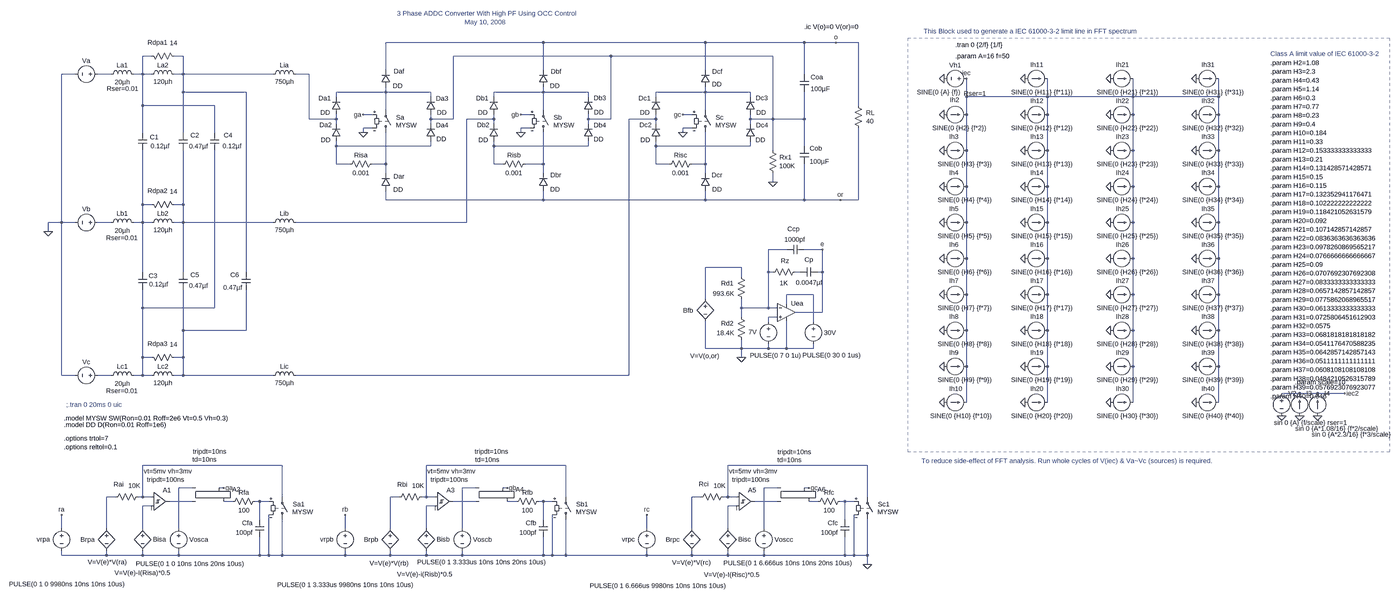
[diagram p0: schematic 3_Phase_High_PF_ACDC_Converter-add IEC61000-3-2 line (fix).asc, whole sheet]
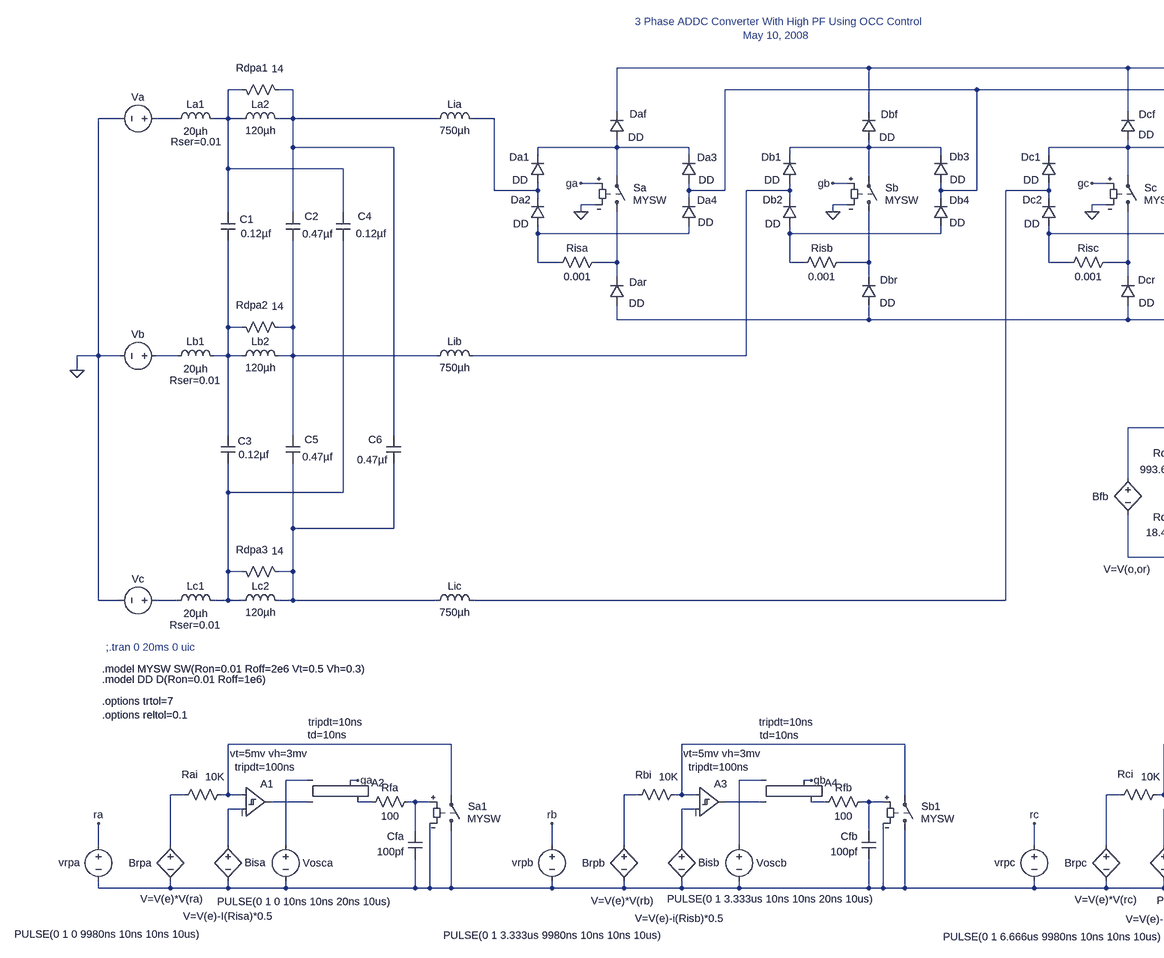
[diagram p1: schematic 3_Phase_High_PF_ACDC_Converter-add IEC61000-3-2 line (fix).asc, part, row 1 of 1, column 1 of 2]
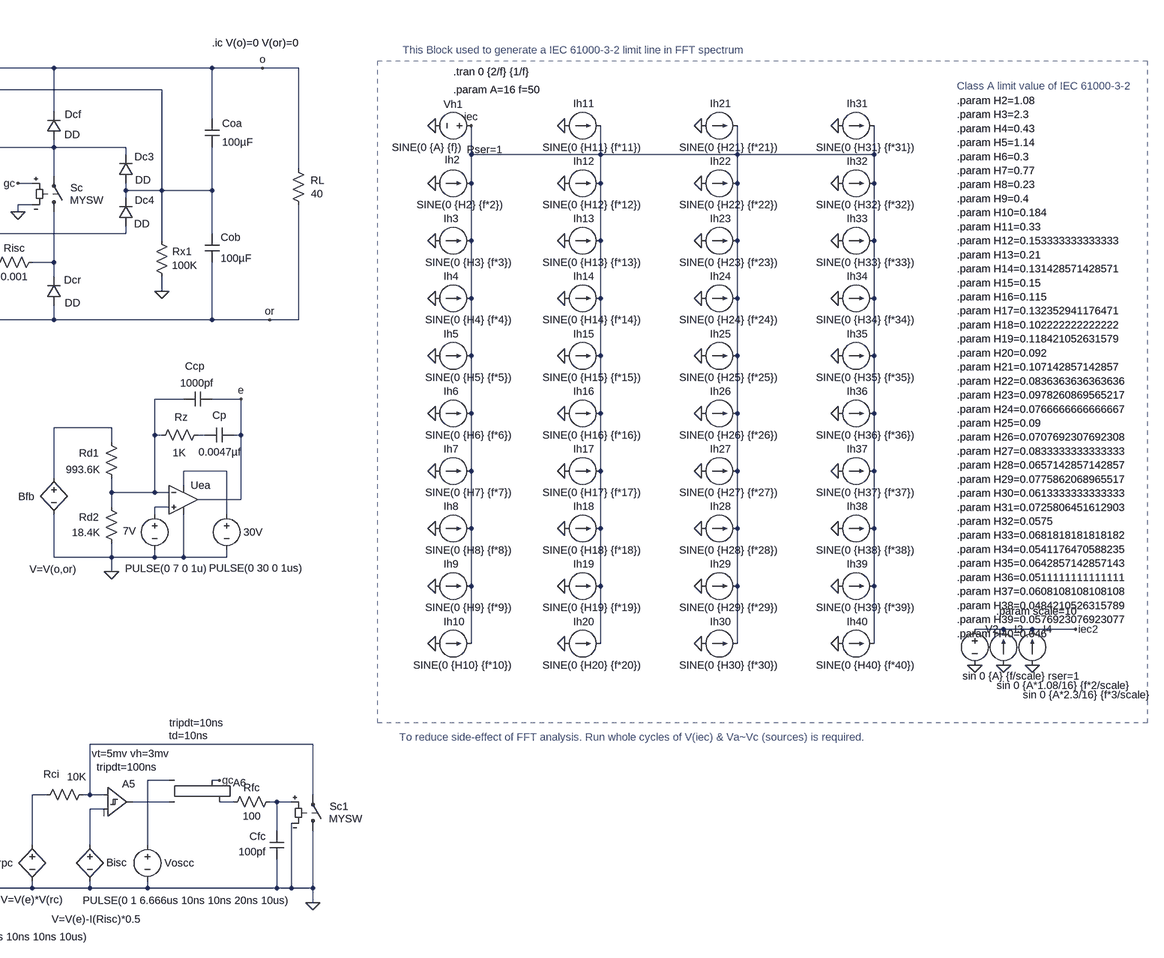
[diagram p2: schematic 3_Phase_High_PF_ACDC_Converter-add IEC61000-3-2 line (fix).asc, part, row 1 of 1, column 2 of 2]
3_Phase_High_PF_ACDC_Converter-add IEC61000-3-2 line (fix).asc, the LTspice schematic file:
Version 4
SHEET 1 1972 680
WIRE -1392 -2016 -1952 -2016
WIRE -816 -2016 -1392 -2016
WIRE -464 -2016 -816 -2016
WIRE -352 -2016 -464 -2016
WIRE -272 -2016 -352 -2016
WIRE -2784 -1968 -2816 -1968
WIRE -2672 -1968 -2704 -1968
WIRE -1152 -1968 -1712 -1968
WIRE -576 -1968 -1152 -1968
WIRE -1952 -1920 -1952 -2016
WIRE -1392 -1920 -1392 -2016
WIRE -816 -1920 -816 -2016
WIRE -3056 -1904 -3104 -1904
WIRE -2928 -1904 -2976 -1904
WIRE -2816 -1904 -2816 -1968
WIRE -2816 -1904 -2848 -1904
WIRE -2784 -1904 -2816 -1904
WIRE -2672 -1904 -2672 -1968
WIRE -2672 -1904 -2704 -1904
WIRE -2352 -1904 -2672 -1904
WIRE -2224 -1904 -2272 -1904
WIRE -464 -1904 -464 -2016
WIRE -2672 -1840 -2672 -1904
WIRE -2448 -1840 -2672 -1840
WIRE -1952 -1840 -1952 -1856
WIRE -1952 -1840 -2128 -1840
WIRE -1792 -1840 -1952 -1840
WIRE -1392 -1840 -1392 -1856
WIRE -1392 -1840 -1568 -1840
WIRE -1232 -1840 -1392 -1840
WIRE -816 -1840 -816 -1856
WIRE -816 -1840 -992 -1840
WIRE -656 -1840 -816 -1840
WIRE -2128 -1824 -2128 -1840
WIRE -1792 -1824 -1792 -1840
WIRE -1568 -1824 -1568 -1840
WIRE -1232 -1824 -1232 -1840
WIRE -992 -1824 -992 -1840
WIRE -656 -1824 -656 -1840
WIRE 112 -1824 112 -1888
WIRE 400 -1824 400 -1888
WIRE 400 -1824 112 -1824
WIRE 704 -1824 704 -1888
WIRE 704 -1824 400 -1824
WIRE 1008 -1824 1008 -1888
WIRE 1008 -1824 704 -1824
WIRE -2816 -1792 -2816 -1904
WIRE -2560 -1792 -2816 -1792
WIRE -272 -1792 -272 -2016
WIRE -1952 -1776 -1952 -1840
WIRE -1392 -1776 -1392 -1840
WIRE -816 -1776 -816 -1840
WIRE -2000 -1760 -2032 -1760
WIRE -1440 -1760 -1472 -1760
WIRE -864 -1760 -896 -1760
WIRE 112 -1760 112 -1824
WIRE 400 -1760 400 -1824
WIRE 704 -1760 704 -1824
WIRE 1008 -1760 1008 -1824
WIRE -2224 -1744 -2224 -1904
WIRE -2128 -1744 -2128 -1760
WIRE -2128 -1744 -2224 -1744
WIRE -1792 -1744 -1792 -1760
WIRE -1712 -1744 -1712 -1968
WIRE -1712 -1744 -1792 -1744
WIRE -1568 -1744 -1568 -1760
WIRE -1568 -1744 -1664 -1744
WIRE -1232 -1744 -1232 -1760
WIRE -1152 -1744 -1152 -1968
WIRE -1152 -1744 -1232 -1744
WIRE -992 -1744 -992 -1760
WIRE -992 -1744 -1088 -1744
WIRE -656 -1744 -656 -1760
WIRE -576 -1744 -576 -1968
WIRE -576 -1744 -656 -1744
WIRE -464 -1744 -464 -1840
WIRE -464 -1744 -576 -1744
WIRE -2128 -1728 -2128 -1744
WIRE -1792 -1728 -1792 -1744
WIRE -1568 -1728 -1568 -1744
WIRE -1232 -1728 -1232 -1744
WIRE -992 -1728 -992 -1744
WIRE -656 -1728 -656 -1744
WIRE -2000 -1712 -2032 -1712
WIRE -1440 -1712 -1472 -1712
WIRE -864 -1712 -896 -1712
WIRE -2816 -1696 -2816 -1792
WIRE -2672 -1696 -2672 -1840
WIRE -2560 -1696 -2560 -1792
WIRE -2032 -1696 -2032 -1712
WIRE -1472 -1696 -1472 -1712
WIRE -896 -1696 -896 -1712
WIRE -2128 -1648 -2128 -1664
WIRE -1792 -1648 -1792 -1664
WIRE -1792 -1648 -2128 -1648
WIRE -1568 -1648 -1568 -1664
WIRE -1232 -1648 -1232 -1664
WIRE -1232 -1648 -1568 -1648
WIRE -992 -1648 -992 -1664
WIRE -656 -1648 -656 -1664
WIRE -656 -1648 -992 -1648
WIRE -464 -1648 -464 -1744
WIRE -576 -1632 -576 -1744
WIRE 112 -1632 112 -1760
WIRE 400 -1632 400 -1760
WIRE 704 -1632 704 -1760
WIRE 1008 -1632 1008 -1760
WIRE -2128 -1584 -2128 -1648
WIRE -2080 -1584 -2128 -1584
WIRE -1952 -1584 -1952 -1696
WIRE -1952 -1584 -2000 -1584
WIRE -1568 -1584 -1568 -1648
WIRE -1536 -1584 -1568 -1584
WIRE -1392 -1584 -1392 -1696
WIRE -1392 -1584 -1456 -1584
WIRE -992 -1584 -992 -1648
WIRE -944 -1584 -992 -1584
WIRE -816 -1584 -816 -1696
WIRE -816 -1584 -864 -1584
WIRE -1952 -1552 -1952 -1584
WIRE -1392 -1552 -1392 -1584
WIRE -816 -1552 -816 -1584
WIRE -576 -1520 -576 -1552
WIRE 112 -1504 112 -1632
WIRE 400 -1504 400 -1632
WIRE 704 -1504 704 -1632
WIRE 1008 -1504 1008 -1632
WIRE -1952 -1456 -1952 -1488
WIRE -1392 -1456 -1392 -1488
WIRE -1392 -1456 -1952 -1456
WIRE -816 -1456 -816 -1488
WIRE -816 -1456 -1392 -1456
WIRE -464 -1456 -464 -1584
WIRE -464 -1456 -816 -1456
WIRE -336 -1456 -464 -1456
WIRE -272 -1456 -272 -1712
WIRE -272 -1456 -336 -1456
WIRE -2816 -1440 -2816 -1632
WIRE -2784 -1440 -2816 -1440
WIRE -2672 -1440 -2672 -1632
WIRE -2672 -1440 -2704 -1440
WIRE -3104 -1376 -3104 -1904
WIRE -3104 -1376 -3152 -1376
WIRE -3056 -1376 -3104 -1376
WIRE -2928 -1376 -2976 -1376
WIRE -2816 -1376 -2816 -1440
WIRE -2816 -1376 -2848 -1376
WIRE -2784 -1376 -2816 -1376
WIRE -2672 -1376 -2672 -1440
WIRE -2672 -1376 -2704 -1376
WIRE -2352 -1376 -2672 -1376
WIRE -1664 -1376 -1664 -1744
WIRE -1664 -1376 -2272 -1376
WIRE 112 -1376 112 -1504
WIRE 400 -1376 400 -1504
WIRE 704 -1376 704 -1504
WIRE 1008 -1376 1008 -1504
WIRE -3152 -1344 -3152 -1376
WIRE -528 -1280 -592 -1280
WIRE -400 -1280 -464 -1280
WIRE 112 -1248 112 -1376
WIRE 400 -1248 400 -1376
WIRE 704 -1248 704 -1376
WIRE 1008 -1248 1008 -1376
WIRE -688 -1216 -816 -1216
WIRE -2816 -1200 -2816 -1376
WIRE -2672 -1200 -2672 -1376
WIRE -2448 -1200 -2448 -1840
WIRE -592 -1200 -592 -1280
WIRE -576 -1200 -592 -1200
WIRE -480 -1200 -496 -1200
WIRE -400 -1200 -400 -1280
WIRE -400 -1200 -416 -1200
WIRE -688 -1184 -688 -1216
WIRE -432 -1120 -528 -1120
WIRE 112 -1120 112 -1248
WIRE 400 -1120 400 -1248
WIRE 704 -1120 704 -1248
WIRE 1008 -1120 1008 -1248
WIRE -816 -1104 -816 -1216
WIRE -528 -1088 -528 -1120
WIRE -2816 -1072 -2816 -1136
WIRE -2560 -1072 -2560 -1632
WIRE -2560 -1072 -2816 -1072
WIRE -688 -1072 -688 -1104
WIRE -592 -1072 -592 -1200
WIRE -592 -1072 -688 -1072
WIRE -560 -1072 -592 -1072
WIRE -400 -1056 -400 -1200
WIRE -400 -1056 -496 -1056
WIRE -688 -1040 -688 -1072
WIRE -560 -1040 -592 -1040
WIRE -592 -1024 -592 -1040
WIRE -432 -1024 -432 -1120
WIRE -2672 -992 -2672 -1136
WIRE -2448 -992 -2448 -1136
WIRE -2448 -992 -2672 -992
WIRE 112 -992 112 -1120
WIRE 400 -992 400 -1120
WIRE 704 -992 704 -1120
WIRE 1008 -992 1008 -1120
WIRE -816 -928 -816 -1024
WIRE -688 -928 -688 -960
WIRE -688 -928 -816 -928
WIRE -592 -928 -592 -944
WIRE -592 -928 -688 -928
WIRE -528 -928 -528 -1024
WIRE -528 -928 -592 -928
WIRE -432 -928 -432 -944
WIRE -432 -928 -528 -928
WIRE -2816 -896 -2816 -1072
WIRE -2784 -896 -2816 -896
WIRE -2672 -896 -2672 -992
WIRE -2672 -896 -2704 -896
WIRE -688 -896 -688 -928
WIRE 112 -864 112 -992
WIRE 400 -864 400 -992
WIRE 704 -864 704 -992
WIRE 1008 -864 1008 -992
WIRE -3104 -832 -3104 -1376
WIRE -3056 -832 -3104 -832
WIRE -2928 -832 -2976 -832
WIRE -2816 -832 -2816 -896
WIRE -2816 -832 -2848 -832
WIRE -2784 -832 -2816 -832
WIRE -2672 -832 -2672 -896
WIRE -2672 -832 -2704 -832
WIRE -2352 -832 -2672 -832
WIRE -1088 -832 -1088 -1744
WIRE -1088 -832 -2272 -832
WIRE 1296 -768 1232 -768
WIRE 1360 -768 1296 -768
WIRE 1456 -768 1360 -768
WIRE 112 -736 112 -864
WIRE 400 -736 400 -864
WIRE 704 -736 704 -864
WIRE 1008 -736 1008 -864
WIRE -2320 -512 -2816 -512
WIRE -1312 -512 -1808 -512
WIRE -240 -512 -736 -512
WIRE -2640 -432 -2688 -432
WIRE -2528 -432 -2544 -432
WIRE -1632 -432 -1680 -432
WIRE -1520 -432 -1536 -432
WIRE -560 -432 -608 -432
WIRE -448 -432 -464 -432
WIRE -2912 -400 -2944 -400
WIRE -2816 -400 -2816 -512
WIRE -2816 -400 -2832 -400
WIRE -2784 -400 -2816 -400
WIRE -2320 -400 -2320 -512
WIRE -1904 -400 -1936 -400
WIRE -1808 -400 -1808 -512
WIRE -1808 -400 -1824 -400
WIRE -1776 -400 -1808 -400
WIRE -1312 -400 -1312 -512
WIRE -832 -400 -864 -400
WIRE -736 -400 -736 -512
WIRE -736 -400 -752 -400
WIRE -704 -400 -736 -400
WIRE -240 -400 -240 -512
WIRE -2640 -384 -2720 -384
WIRE -2496 -384 -2528 -384
WIRE -2400 -384 -2416 -384
WIRE -2368 -384 -2400 -384
WIRE -1632 -384 -1712 -384
WIRE -1488 -384 -1520 -384
WIRE -1392 -384 -1408 -384
WIRE -1360 -384 -1392 -384
WIRE -560 -384 -640 -384
WIRE -416 -384 -448 -384
WIRE -320 -384 -336 -384
WIRE -288 -384 -320 -384
WIRE -2784 -368 -2816 -368
WIRE -1776 -368 -1808 -368
WIRE -704 -368 -736 -368
WIRE -2400 -320 -2400 -384
WIRE -1392 -320 -1392 -384
WIRE -320 -320 -320 -384
WIRE -3104 -288 -3104 -336
WIRE -2944 -288 -2944 -400
WIRE -2816 -288 -2816 -368
WIRE -2688 -288 -2688 -432
WIRE -2096 -288 -2096 -336
WIRE -1936 -288 -1936 -400
WIRE -1808 -288 -1808 -368
WIRE -1680 -288 -1680 -432
WIRE -1024 -288 -1024 -336
WIRE -864 -288 -864 -400
WIRE -736 -288 -736 -368
WIRE -608 -288 -608 -432
WIRE -3104 -192 -3104 -208
WIRE -2944 -192 -2944 -208
WIRE -2944 -192 -3104 -192
WIRE -2816 -192 -2816 -208
WIRE -2816 -192 -2944 -192
WIRE -2688 -192 -2688 -208
WIRE -2688 -192 -2816 -192
WIRE -2400 -192 -2400 -256
WIRE -2400 -192 -2688 -192
WIRE -2368 -192 -2368 -336
WIRE -2368 -192 -2400 -192
WIRE -2320 -192 -2320 -320
WIRE -2320 -192 -2368 -192
WIRE -2096 -192 -2096 -208
WIRE -2096 -192 -2320 -192
WIRE -1936 -192 -1936 -208
WIRE -1936 -192 -2096 -192
WIRE -1808 -192 -1808 -208
WIRE -1808 -192 -1936 -192
WIRE -1680 -192 -1680 -208
WIRE -1680 -192 -1808 -192
WIRE -1392 -192 -1392 -256
WIRE -1392 -192 -1680 -192
WIRE -1360 -192 -1360 -336
WIRE -1360 -192 -1392 -192
WIRE -1312 -192 -1312 -320
WIRE -1312 -192 -1360 -192
WIRE -1024 -192 -1024 -208
WIRE -1024 -192 -1312 -192
WIRE -864 -192 -864 -208
WIRE -864 -192 -1024 -192
WIRE -736 -192 -736 -208
WIRE -736 -192 -864 -192
WIRE -608 -192 -608 -208
WIRE -608 -192 -736 -192
WIRE -320 -192 -320 -256
WIRE -320 -192 -608 -192
WIRE -288 -192 -288 -336
WIRE -288 -192 -320 -192
WIRE -240 -192 -240 -320
WIRE -240 -192 -288 -192
WIRE -240 -160 -240 -192
FLAG -576 -1520 0
FLAG -352 -2016 o
FLAG -3104 -336 ra
FLAG -2528 -432 ga
FLAG -1520 -432 gb
FLAG -448 -432 gc
FLAG -2096 -336 rb
FLAG -1024 -336 rc
FLAG -400 -1280 e
FLAG -688 -896 0
FLAG -336 -1456 or
FLAG -240 -160 0
FLAG -2032 -1760 ga
FLAG -2032 -1696 0
FLAG -1472 -1760 gb
FLAG -1472 -1696 0
FLAG -896 -1760 gc
FLAG -896 -1696 0
FLAG -3152 -1344 0
FLAG 32 -1888 0
FLAG 32 -1760 0
FLAG 32 -1632 0
FLAG 112 -1888 iec
FLAG 1232 -688 0
FLAG 1296 -688 0
FLAG 1360 -688 0
FLAG 1456 -768 iec2
FLAG 32 -1504 0
FLAG 32 -1376 0
FLAG 32 -1248 0
FLAG 32 -1120 0
FLAG 32 -992 0
FLAG 32 -864 0
FLAG 32 -736 0
FLAG 320 -1888 0
FLAG 320 -1760 0
FLAG 320 -1632 0
FLAG 320 -1504 0
FLAG 320 -1376 0
FLAG 320 -1248 0
FLAG 320 -1120 0
FLAG 320 -992 0
FLAG 320 -864 0
FLAG 320 -736 0
FLAG 624 -1888 0
FLAG 624 -1760 0
FLAG 624 -1632 0
FLAG 624 -1504 0
FLAG 624 -1376 0
FLAG 624 -1248 0
FLAG 624 -1120 0
FLAG 624 -992 0
FLAG 624 -864 0
FLAG 624 -736 0
FLAG 928 -1888 0
FLAG 928 -1760 0
FLAG 928 -1632 0
FLAG 928 -1504 0
FLAG 928 -1376 0
FLAG 928 -1248 0
FLAG 928 -1120 0
FLAG 928 -992 0
FLAG 928 -864 0
FLAG 928 -736 0
SYMBOL ind -2368 -1888 R270
WINDOW 0 32 56 VTop 2
WINDOW 3 5 56 VBottom 2
SYMATTR InstName Lia
SYMATTR Value 750µh
SYMATTR Type ind2
SYMATTR SpiceLine Rser=0.01
SYMBOL ind -2368 -1360 R270
WINDOW 0 32 56 VTop 2
WINDOW 3 5 56 VBottom 2
SYMATTR InstName Lib
SYMATTR Value 750µh
SYMATTR Type ind2
SYMATTR SpiceLine Rser=0.01
SYMBOL ind -2368 -816 R270
WINDOW 0 32 56 VTop 2
WINDOW 3 5 56 VBottom 2
SYMATTR InstName Lic
SYMATTR Value 750µh
SYMATTR Type ind2
SYMATTR SpiceLine Rser=0.01
SYMBOL cap -480 -1648 R0
WINDOW 0 35 8 Left 2
WINDOW 3 35 55 Left 2
SYMATTR InstName Cob
SYMATTR Value 100µF
SYMATTR SpiceLine Rser=0.1
SYMBOL cap -480 -1904 R0
WINDOW 0 38 11 Left 2
WINDOW 3 38 53 Left 2
SYMATTR InstName Coa
SYMATTR Value 100µF
SYMATTR SpiceLine Rser=0.1
SYMBOL res -288 -1808 R0
WINDOW 0 43 42 Left 2
WINDOW 3 44 72 Left 2
SYMATTR InstName RL
SYMATTR Value 40
SYMBOL res -1984 -1600 R90
WINDOW 0 0 56 VBottom 2
WINDOW 3 32 56 VTop 2
SYMATTR InstName Risa
SYMATTR Value 0.001
SYMBOL res -1440 -1600 R90
WINDOW 0 0 56 VBottom 2
WINDOW 3 32 56 VTop 2
SYMATTR InstName Risb
SYMATTR Value 0.001
SYMBOL res -848 -1600 R90
WINDOW 0 0 56 VBottom 2
WINDOW 3 32 56 VTop 2
SYMATTR InstName Risc
SYMATTR Value 0.001
SYMBOL res -560 -1536 R180
WINDOW 0 -50 72 Left 2
WINDOW 3 -63 41 Left 2
SYMATTR InstName Rx1
SYMATTR Value 100K
SYMBOL voltage -3104 -304 R0
WINDOW 0 -89 55 Left 2
WINDOW 3 -187 214 Left 2
WINDOW 123 0 0 Left 2
WINDOW 39 0 0 Left 2
SYMATTR InstName vrpa
SYMATTR Value PULSE(0 1 0 9980ns 10ns 10ns 10us)
SYMBOL bv -2944 -304 R0
WINDOW 0 -93 56 Left 2
WINDOW 3 -67 136 Left 2
SYMATTR InstName Brpa
SYMATTR Value V=V(e)*V(ra)
SYMBOL Digital\\diffschmtbuf -2784 -448 R0
WINDOW 3 -17 -13 Left 2
WINDOW 123 -28 -43 Left 2
SYMATTR Value tripdt=100ns
SYMATTR Value2 vt=5mv vh=3mv
SYMATTR InstName A1
SYMBOL Digital\\srflop -2592 -480 R0
WINDOW 3 -46 -81 Left 2
WINDOW 123 -47 -53 Left 2
SYMATTR Value tripdt=10ns
SYMATTR Value2 td=10ns
SYMATTR InstName A2
SYMBOL voltage -2688 -304 R0
WINDOW 0 38 56 Left 2
WINDOW 3 -152 142 Left 2
WINDOW 123 0 0 Left 2
WINDOW 39 0 0 Left 2
SYMATTR InstName Vosca
SYMATTR Value PULSE(0 1 0 10ns 10ns 20ns 10us)
SYMBOL res -2816 -416 R90
WINDOW 0 -13 85 VBottom 2
WINDOW 3 -39 29 VTop 2
SYMATTR InstName Rai
SYMATTR Value 10K
SYMBOL sw -2320 -304 M180
WINDOW 0 37 70 Left 2
WINDOW 3 36 42 Left 2
SYMATTR InstName Sa1
SYMATTR Value MYSW
SYMBOL res -2400 -400 R90
WINDOW 0 0 56 VBottom 2
WINDOW 3 32 56 VTop 2
SYMATTR InstName Rfa
SYMATTR Value 100
SYMBOL cap -2384 -320 M0
WINDOW 0 41 13 Left 2
WINDOW 3 40 47 Left 2
SYMATTR InstName Cfa
SYMATTR Value 100pf
SYMBOL bv -2816 -304 R0
WINDOW 0 37 55 Left 2
WINDOW 3 -100 174 Left 2
SYMATTR InstName Bisa
SYMATTR Value V=V(e)-I(Risa)*0.5
SYMBOL Digital\\diffschmtbuf -1776 -448 R0
WINDOW 3 -17 -13 Left 2
WINDOW 123 -28 -43 Left 2
SYMATTR Value tripdt=100ns
SYMATTR Value2 vt=5mv vh=3mv
SYMATTR InstName A3
SYMBOL Digital\\srflop -1584 -480 R0
WINDOW 3 -52 -81 Left 2
WINDOW 123 -50 -52 Left 2
SYMATTR Value tripdt=10ns
SYMATTR Value2 td=10ns
SYMATTR InstName A4
SYMBOL res -1808 -416 R90
WINDOW 0 -12 85 VBottom 2
WINDOW 3 -39 29 VTop 2
SYMATTR InstName Rbi
SYMATTR Value 10K
SYMBOL sw -1312 -304 M180
WINDOW 0 37 70 Left 2
WINDOW 3 36 42 Left 2
SYMATTR InstName Sb1
SYMATTR Value MYSW
SYMBOL res -1392 -400 R90
WINDOW 0 0 56 VBottom 2
WINDOW 3 32 56 VTop 2
SYMATTR InstName Rfb
SYMATTR Value 100
SYMBOL cap -1376 -320 M0
WINDOW 0 41 13 Left 2
WINDOW 3 40 47 Left 2
SYMATTR InstName Cfb
SYMATTR Value 100pf
SYMBOL bv -1808 -304 R0
WINDOW 0 37 55 Left 2
WINDOW 3 -104 179 Left 2
SYMATTR InstName Bisb
SYMATTR Value V=V(e)-i(Risb)*0.5
SYMBOL Digital\\diffschmtbuf -704 -448 R0
WINDOW 3 -17 -13 Left 2
WINDOW 123 -28 -43 Left 2
SYMATTR Value tripdt=100ns
SYMATTR Value2 vt=5mv vh=3mv
SYMATTR InstName A5
SYMBOL Digital\\srflop -512 -480 R0
WINDOW 3 -47 -80 Left 2
WINDOW 123 -48 -51 Left 2
SYMATTR Value tripdt=10ns
SYMATTR Value2 td=10ns
SYMATTR InstName A6
SYMBOL res -736 -416 R90
WINDOW 0 -14 86 VBottom 2
WINDOW 3 -39 29 VTop 2
SYMATTR InstName Rci
SYMATTR Value 10K
SYMBOL sw -240 -304 M180
WINDOW 0 37 70 Left 2
WINDOW 3 36 42 Left 2
SYMATTR InstName Sc1
SYMATTR Value MYSW
SYMBOL res -320 -400 R90
WINDOW 0 0 56 VBottom 2
WINDOW 3 32 56 VTop 2
SYMATTR InstName Rfc
SYMATTR Value 100
SYMBOL cap -304 -320 M0
WINDOW 0 41 13 Left 2
WINDOW 3 40 47 Left 2
SYMATTR InstName Cfc
SYMATTR Value 100pf
SYMBOL bv -736 -304 R0
WINDOW 0 37 55 Left 2
WINDOW 3 -85 181 Left 2
SYMATTR InstName Bisc
SYMATTR Value V=V(e)-I(Risc)*0.5
SYMBOL voltage -2096 -304 R0
WINDOW 0 -89 55 Left 2
WINDOW 3 -242 217 Left 2
WINDOW 123 0 0 Left 2
WINDOW 39 0 0 Left 2
SYMATTR InstName vrpb
SYMATTR Value PULSE(0 1 3.333us 9980ns 10ns 10ns 10us)
SYMBOL bv -1936 -304 R0
WINDOW 0 -93 56 Left 2
WINDOW 3 -73 140 Left 2
SYMATTR InstName Brpb
SYMATTR Value V=V(e)*V(rb)
SYMBOL voltage -1024 -304 R0
WINDOW 0 -89 55 Left 2
WINDOW 3 -203 220 Left 2
WINDOW 123 0 0 Left 2
WINDOW 39 0 0 Left 2
SYMATTR InstName vrpc
SYMATTR Value PULSE(0 1 6.666us 9980ns 10ns 10ns 10us)
SYMBOL bv -864 -304 R0
WINDOW 0 -93 56 Left 2
WINDOW 3 -70 138 Left 2
SYMATTR InstName Brpc
SYMATTR Value V=V(e)*V(rc)
SYMBOL voltage -1680 -304 R0
WINDOW 0 38 56 Left 2
WINDOW 3 -160 136 Left 2
WINDOW 123 0 0 Left 2
WINDOW 39 0 0 Left 2
SYMATTR InstName Voscb
SYMATTR Value PULSE(0 1 3.333us 10ns 10ns 20ns 10us)
SYMBOL voltage -608 -304 R0
WINDOW 0 38 56 Left 2
WINDOW 3 -144 139 Left 2
WINDOW 123 0 0 Left 2
WINDOW 39 0 0 Left 2
SYMATTR InstName Voscc
SYMATTR Value PULSE(0 1 6.666us 10ns 10ns 20ns 10us)
SYMBOL res -704 -1200 R0
WINDOW 0 -56 40 Left 2
WINDOW 3 -85 77 Left 2
SYMATTR InstName Rd1
SYMATTR Value 993.6K
SYMBOL res -704 -1056 R0
WINDOW 0 -56 39 Left 2
WINDOW 3 -72 73 Left 2
SYMATTR InstName Rd2
SYMATTR Value 18.4K
SYMBOL res -480 -1216 R90
WINDOW 0 -8 53 VBottom 2
WINDOW 3 40 57 VTop 2
SYMATTR InstName Rz
SYMATTR Value 1K
SYMBOL cap -416 -1216 R90
WINDOW 0 -12 32 VBottom 2
WINDOW 3 38 31 VTop 2
SYMATTR InstName Cp
SYMATTR Value 0.0047µf
SYMBOL cap -464 -1296 R90
WINDOW 0 -41 39 VBottom 2
WINDOW 3 -35 34 VTop 2
SYMATTR InstName Ccp
SYMATTR Value 1000pf
SYMBOL voltage -592 -1040 R0
WINDOW 0 -71 54 Left 2
WINDOW 3 -66 137 Left 2
WINDOW 123 0 0 Left 2
WINDOW 39 0 0 Left 2
SYMATTR InstName 7V
SYMATTR Value PULSE(0 7 0 1u)
SYMBOL bv -816 -1120 R0
WINDOW 0 -79 57 Left 2
WINDOW 3 -54 219 Left 2
SYMATTR InstName Bfb
SYMATTR Value V=V(o,or)
SYMBOL voltage -432 -1040 R0
WINDOW 0 38 56 Left 2
WINDOW 3 -39 136 Left 2
WINDOW 123 0 0 Left 2
WINDOW 39 0 0 Left 2
SYMATTR InstName 30V
SYMATTR Value PULSE(0 30 0 1us)
SYMBOL sw -1952 -1680 M180
WINDOW 0 37 70 Left 2
WINDOW 3 36 42 Left 2
SYMATTR InstName Sa
SYMATTR Value MYSW
SYMBOL sw -1392 -1680 M180
WINDOW 0 37 70 Left 2
WINDOW 3 36 42 Left 2
SYMATTR InstName Sb
SYMATTR Value MYSW
SYMBOL sw -816 -1680 M180
WINDOW 0 37 70 Left 2
WINDOW 3 36 42 Left 2
SYMATTR InstName Sc
SYMATTR Value MYSW
SYMBOL diode -2112 -1760 R180
WINDOW 0 35 58 Left 2
WINDOW 3 38 7 Left 2
SYMATTR InstName Da1
SYMATTR Value DD
SYMBOL diode -2112 -1664 R180
WINDOW 0 31 59 Left 2
WINDOW 3 36 6 Left 2
SYMATTR InstName Da2
SYMATTR Value DD
SYMBOL diode -1776 -1760 R180
WINDOW 0 -47 57 Left 2
WINDOW 3 -40 7 Left 2
SYMATTR InstName Da3
SYMATTR Value DD
SYMBOL diode -1776 -1664 R180
WINDOW 0 -47 58 Left 2
WINDOW 3 -39 9 Left 2
SYMATTR InstName Da4
SYMATTR Value DD
SYMBOL diode -1552 -1760 R180
WINDOW 0 35 58 Left 2
WINDOW 3 38 7 Left 2
SYMATTR InstName Db1
SYMATTR Value DD
SYMBOL diode -1552 -1664 R180
WINDOW 0 31 59 Left 2
WINDOW 3 36 6 Left 2
SYMATTR InstName Db2
SYMATTR Value DD
SYMBOL diode -1216 -1760 R180
WINDOW 0 -48 59 Left 2
WINDOW 3 -39 8 Left 2
SYMATTR InstName Db3
SYMATTR Value DD
SYMBOL diode -1216 -1664 R180
WINDOW 0 -48 58 Left 2
WINDOW 3 -38 8 Left 2
SYMATTR InstName Db4
SYMATTR Value DD
SYMBOL diode -976 -1760 R180
WINDOW 0 35 58 Left 2
WINDOW 3 38 7 Left 2
SYMATTR InstName Dc1
SYMATTR Value DD
SYMBOL diode -976 -1664 R180
WINDOW 0 31 59 Left 2
WINDOW 3 36 6 Left 2
SYMATTR InstName Dc2
SYMATTR Value DD
SYMBOL diode -640 -1760 R180
WINDOW 0 -46 59 Left 2
WINDOW 3 -39 7 Left 2
SYMATTR InstName Dc3
SYMATTR Value DD
SYMBOL diode -640 -1664 R180
WINDOW 0 -47 58 Left 2
WINDOW 3 -37 6 Left 2
SYMATTR InstName Dc4
SYMATTR Value DD
SYMBOL diode -1936 -1856 R180
WINDOW 0 -50 58 Left 2
WINDOW 3 -44 6 Left 2
SYMATTR InstName Daf
SYMATTR Value DD
SYMBOL diode -1376 -1856 R180
WINDOW 0 -48 57 Left 2
WINDOW 3 -42 6 Left 2
SYMATTR InstName Dbf
SYMATTR Value DD
SYMBOL diode -800 -1856 R180
WINDOW 0 -44 57 Left 2
WINDOW 3 -42 12 Left 2
SYMATTR InstName Dcf
SYMATTR Value DD
SYMBOL diode -1936 -1488 R180
WINDOW 0 -51 52 Left 2
WINDOW 3 -45 5 Left 2
SYMATTR InstName Dar
SYMATTR Value DD
SYMBOL diode -1376 -1488 R180
WINDOW 0 -48 57 Left 2
WINDOW 3 -43 6 Left 2
SYMATTR InstName Dbr
SYMATTR Value DD
SYMBOL diode -800 -1488 R180
WINDOW 0 -44 57 Left 2
WINDOW 3 -43 6 Left 2
SYMATTR InstName Dcr
SYMATTR Value DD
SYMBOL voltage -2960 -1904 R90
WINDOW 0 -32 56 VBottom 2
WINDOW 3 32 56 Invisible 2
WINDOW 123 0 0 Left 2
WINDOW 39 0 0 Left 2
SYMATTR InstName Va
SYMATTR Value SINE(0 134 {f})
SYMBOL voltage -2960 -1376 R90
WINDOW 0 -32 56 VBottom 2
WINDOW 3 32 56 Invisible 2
WINDOW 123 0 0 Left 2
WINDOW 39 0 0 Left 2
SYMATTR InstName Vb
SYMATTR Value SINE(0 134 {f} 0 0 120)
SYMBOL voltage -2960 -832 R90
WINDOW 0 -32 56 VBottom 2
WINDOW 3 32 56 Invisible 2
WINDOW 123 0 0 Left 2
WINDOW 39 0 0 Left 2
SYMATTR InstName Vc
SYMATTR Value SINE(0 134 {f} 0 0 240)
SYMBOL ind -2944 -1888 R270
WINDOW 0 32 56 VTop 2
WINDOW 3 3 56 VBottom 2
WINDOW 39 -20 57 VBottom 2
SYMATTR InstName La1
SYMATTR Value 20µh
SYMATTR SpiceLine Rser=0.01
SYMBOL ind -2800 -1888 R270
WINDOW 0 32 56 VTop 2
WINDOW 3 5 56 VBottom 2
SYMATTR InstName La2
SYMATTR Value 120µh
SYMATTR SpiceLine Rser=0.01
SYMBOL cap -2832 -1696 R0
WINDOW 0 42 16 Left 2
WINDOW 3 44 48 Left 2
SYMATTR InstName C1
SYMATTR Value 0.12µf
SYMATTR SpiceLine Rser=0.01 Cpar=100pf
SYMBOL cap -2688 -1696 R0
WINDOW 0 42 10 Left 2
WINDOW 3 37 49 Left 2
SYMATTR InstName C2
SYMATTR Value 0.47µf
SYMATTR SpiceLine Rser=0.01 Cpar=100pf
SYMBOL res -2800 -1984 M90
WINDOW 0 -17 37 VBottom 2
WINDOW 3 -46 94 VTop 2
SYMATTR InstName Rdpa1
SYMATTR Value 14
SYMBOL ind -2944 -1360 R270
WINDOW 0 32 56 VTop 2
WINDOW 3 3 56 VBottom 2
WINDOW 39 -23 54 VBottom 2
SYMATTR InstName Lb1
SYMATTR Value 20µh
SYMATTR SpiceLine Rser=0.01
SYMBOL ind -2800 -1360 R270
WINDOW 0 32 56 VTop 2
WINDOW 3 5 56 VBottom 2
SYMATTR InstName Lb2
SYMATTR Value 120µh
SYMATTR SpiceLine Rser=0.01
SYMBOL cap -2832 -1200 R0
WINDOW 0 38 14 Left 2
WINDOW 3 39 44 Left 2
SYMATTR InstName C3
SYMATTR Value 0.12µf
SYMATTR SpiceLine Rser=0.01 Cpar=100pf
SYMBOL res -2800 -1456 M90
WINDOW 0 -17 37 VBottom 2
WINDOW 3 -46 94 VTop 2
SYMATTR InstName Rdpa2
SYMATTR Value 14
SYMBOL ind -2944 -816 R270
WINDOW 0 32 56 VTop 2
WINDOW 3 3 56 VBottom 2
WINDOW 39 -23 54 VBottom 2
SYMATTR InstName Lc1
SYMATTR Value 20µh
SYMATTR SpiceLine Rser=0.01
SYMBOL ind -2800 -816 R270
WINDOW 0 32 56 VTop 2
WINDOW 3 5 56 VBottom 2
SYMATTR InstName Lc2
SYMATTR Value 120µh
SYMATTR SpiceLine Rser=0.01
SYMBOL res -2800 -912 M90
WINDOW 0 -17 37 VBottom 2
WINDOW 3 -46 94 VTop 2
SYMATTR InstName Rdpa3
SYMATTR Value 14
SYMBOL cap -2576 -1696 R0
WINDOW 0 48 10 Left 2
WINDOW 3 44 48 Left 2
SYMATTR InstName C4
SYMATTR Value 0.12µf
SYMATTR SpiceLine Rser=0.01 Cpar=100pf
SYMBOL cap -2688 -1200 R0
WINDOW 0 42 10 Left 2
WINDOW 3 37 49 Left 2
SYMATTR InstName C5
SYMATTR Value 0.47µf
SYMATTR SpiceLine Rser=0.01 Cpar=100pf
SYMBOL cap -2464 -1200 R0
WINDOW 0 -40 10 Left 2
WINDOW 3 -65 55 Left 2
SYMATTR InstName C6
SYMATTR Value 0.47µf
SYMATTR SpiceLine Rser=0.01 Cpar=100pf
SYMBOL Opamps\\UniversalOpamp2 -528 -1056 R0
SYMATTR InstName Uea
SYMBOL voltage 128 -1888 R90
WINDOW 3 33 115 VTop 2
WINDOW 0 -32 56 VBottom 2
WINDOW 123 0 0 Left 2
WINDOW 39 38 -14 VTop 2
SYMATTR Value SINE(0 {A} {f})
SYMATTR InstName Vh1
SYMATTR SpiceLine Rser=1
SYMBOL current 32 -1760 M90
WINDOW 0 -52 55 VLeft 2
WINDOW 3 48 55 VCenter 2
WINDOW 123 0 0 Left 2
WINDOW 39 0 0 Left 2
SYMATTR InstName Ih2
SYMATTR Value SINE(0 {H2} {f*2})
SYMBOL current 32 -1632 M90
WINDOW 0 -49 19 VRight 2
WINDOW 3 48 170 VLeft 2
WINDOW 123 0 0 Left 2
WINDOW 39 0 0 Left 2
SYMATTR InstName Ih3
SYMATTR Value SINE(0 {H3} {f*3})
SYMBOL voltage 1232 -784 R0
WINDOW 3 -27 120 Left 2
SYMATTR Value sin 0 {A} {f/scale} rser=1
SYMATTR InstName V2
SYMBOL current 1296 -688 M180
WINDOW 0 24 80 Left 2
WINDOW 3 -15 -45 Left 2
SYMATTR InstName I3
SYMATTR Value sin 0 {A*1.08/16} {f*2/scale}
SYMBOL current 1360 -688 M180
WINDOW 0 24 80 Left 2
WINDOW 3 -21 -66 Left 2
SYMATTR InstName I4
SYMATTR Value sin 0 {A*2.3/16} {f*3/scale}
SYMBOL current 32 -1504 M90
WINDOW 0 -49 19 VRight 2
WINDOW 3 48 170 VLeft 2
WINDOW 123 0 0 Left 2
WINDOW 39 0 0 Left 2
SYMATTR InstName Ih4
SYMATTR Value SINE(0 {H4} {f*4})
SYMBOL current 32 -1376 M90
WINDOW 0 -49 19 VRight 2
WINDOW 3 48 170 VLeft 2
WINDOW 123 0 0 Left 2
WINDOW 39 0 0 Left 2
SYMATTR InstName Ih5
SYMATTR Value SINE(0 {H5} {f*5})
SYMBOL current 32 -1248 M90
WINDOW 0 -49 19 VRight 2
WINDOW 3 48 170 VLeft 2
WINDOW 123 0 0 Left 2
WINDOW 39 0 0 Left 2
SYMATTR InstName Ih6
SYMATTR Value SINE(0 {H6} {f*6})
SYMBOL current 32 -1120 M90
WINDOW 0 -49 19 VRight 2
WINDOW 3 48 170 VLeft 2
WINDOW 123 0 0 Left 2
WINDOW 39 0 0 Left 2
SYMATTR InstName Ih7
SYMATTR Value SINE(0 {H7} {f*7})
SYMBOL current 32 -992 M90
WINDOW 0 -49 19 VRight 2
WINDOW 3 48 170 VLeft 2
WINDOW 123 0 0 Left 2
WINDOW 39 0 0 Left 2
SYMATTR InstName Ih8
SYMATTR Value SINE(0 {H8} {f*8})
SYMBOL current 32 -864 M90
WINDOW 0 -49 19 VRight 2
WINDOW 3 48 170 VLeft 2
WINDOW 123 0 0 Left 2
WINDOW 39 0 0 Left 2
SYMATTR InstName Ih9
SYMATTR Value SINE(0 {H9} {f*9})
SYMBOL current 32 -736 M90
WINDOW 0 -49 19 VRight 2
WINDOW 3 48 170 VLeft 2
WINDOW 123 0 0 Left 2
WINDOW 39 0 0 Left 2
SYMATTR InstName Ih10
SYMATTR Value SINE(0 {H10} {f*10})
SYMBOL current 320 -1888 M90
WINDOW 0 -49 19 VRight 2
WINDOW 3 48 170 VLeft 2
WINDOW 123 0 0 Left 2
WINDOW 39 0 0 Left 2
SYMATTR InstName Ih11
SYMATTR Value SINE(0 {H11} {f*11})
SYMBOL current 320 -1760 M90
WINDOW 0 -49 19 VRight 2
WINDOW 3 48 170 VLeft 2
WINDOW 123 0 0 Left 2
WINDOW 39 0 0 Left 2
SYMATTR InstName Ih12
SYMATTR Value SINE(0 {H12} {f*12})
SYMBOL current 320 -1632 M90
WINDOW 0 -49 19 VRight 2
WINDOW 3 48 170 VLeft 2
WINDOW 123 0 0 Left 2
WINDOW 39 0 0 Left 2
SYMATTR InstName Ih13
SYMATTR Value SINE(0 {H13} {f*13})
SYMBOL current 320 -1504 M90
WINDOW 0 -49 19 VRight 2
WINDOW 3 48 170 VLeft 2
WINDOW 123 0 0 Left 2
WINDOW 39 0 0 Left 2
SYMATTR InstName Ih14
SYMATTR Value SINE(0 {H14} {f*14})
SYMBOL current 320 -1376 M90
WINDOW 0 -49 19 VRight 2
WINDOW 3 48 170 VLeft 2
WINDOW 123 0 0 Left 2
WINDOW 39 0 0 Left 2
SYMATTR InstName Ih15
SYMATTR Value SINE(0 {H15} {f*15})
SYMBOL current 320 -1248 M90
WINDOW 0 -49 19 VRight 2
WINDOW 3 48 170 VLeft 2
WINDOW 123 0 0 Left 2
WINDOW 39 0 0 Left 2
SYMATTR InstName Ih16
SYMATTR Value SINE(0 {H16} {f*16})
SYMBOL current 320 -1120 M90
WINDOW 0 -49 19 VRight 2
WINDOW 3 48 170 VLeft 2
WINDOW 123 0 0 Left 2
WINDOW 39 0 0 Left 2
SYMATTR InstName Ih17
SYMATTR Value SINE(0 {H17} {f*17})
SYMBOL current 320 -992 M90
WINDOW 0 -49 19 VRight 2
WINDOW 3 48 170 VLeft 2
WINDOW 123 0 0 Left 2
WINDOW 39 0 0 Left 2
SYMATTR InstName Ih18
SYMATTR Value SINE(0 {H18} {f*18})
SYMBOL current 320 -864 M90
WINDOW 0 -49 19 VRight 2
WINDOW 3 48 170 VLeft 2
WINDOW 123 0 0 Left 2
WINDOW 39 0 0 Left 2
SYMATTR InstName Ih19
SYMATTR Value SINE(0 {H19} {f*19})
SYMBOL current 320 -736 M90
WINDOW 0 -49 19 VRight 2
WINDOW 3 48 170 VLeft 2
WINDOW 123 0 0 Left 2
WINDOW 39 0 0 Left 2
SYMATTR InstName Ih20
SYMATTR Value SINE(0 {H20} {f*20})
SYMBOL current 624 -1888 M90
WINDOW 0 -49 19 VRight 2
WINDOW 3 48 170 VLeft 2
WINDOW 123 0 0 Left 2
WINDOW 39 0 0 Left 2
SYMATTR InstName Ih21
SYMATTR Value SINE(0 {H21} {f*21})
SYMBOL current 624 -1760 M90
WINDOW 0 -49 19 VRight 2
WINDOW 3 48 170 VLeft 2
WINDOW 123 0 0 Left 2
WINDOW 39 0 0 Left 2
SYMATTR InstName Ih22
SYMATTR Value SINE(0 {H22} {f*22})
SYMBOL current 624 -1632 M90
WINDOW 0 -49 19 VRight 2
WINDOW 3 48 170 VLeft 2
WINDOW 123 0 0 Left 2
WINDOW 39 0 0 Left 2
SYMATTR InstName Ih23
SYMATTR Value SINE(0 {H23} {f*23})
SYMBOL current 624 -1504 M90
WINDOW 0 -49 19 VRight 2
WINDOW 3 48 170 VLeft 2
WINDOW 123 0 0 Left 2
WINDOW 39 0 0 Left 2
SYMATTR InstName Ih24
SYMATTR Value SINE(0 {H24} {f*24})
SYMBOL current 624 -1376 M90
WINDOW 0 -49 19 VRight 2
WINDOW 3 48 170 VLeft 2
WINDOW 123 0 0 Left 2
WINDOW 39 0 0 Left 2
SYMATTR InstName Ih25
SYMATTR Value SINE(0 {H25} {f*25})
SYMBOL current 624 -1248 M90
WINDOW 0 -49 19 VRight 2
WINDOW 3 48 170 VLeft 2
WINDOW 123 0 0 Left 2
WINDOW 39 0 0 Left 2
SYMATTR InstName Ih26
SYMATTR Value SINE(0 {H26} {f*26})
SYMBOL current 624 -1120 M90
WINDOW 0 -49 19 VRight 2
WINDOW 3 48 170 VLeft 2
WINDOW 123 0 0 Left 2
WINDOW 39 0 0 Left 2
SYMATTR InstName Ih27
SYMATTR Value SINE(0 {H27} {f*27})
SYMBOL current 624 -992 M90
WINDOW 0 -49 19 VRight 2
WINDOW 3 48 170 VLeft 2
WINDOW 123 0 0 Left 2
WINDOW 39 0 0 Left 2
SYMATTR InstName Ih28
SYMATTR Value SINE(0 {H28} {f*28})
SYMBOL current 624 -864 M90
WINDOW 0 -49 19 VRight 2
WINDOW 3 48 170 VLeft 2
WINDOW 123 0 0 Left 2
WINDOW 39 0 0 Left 2
SYMATTR InstName Ih29
SYMATTR Value SINE(0 {H29} {f*29})
SYMBOL current 624 -736 M90
WINDOW 0 -49 19 VRight 2
WINDOW 3 48 170 VLeft 2
WINDOW 123 0 0 Left 2
WINDOW 39 0 0 Left 2
SYMATTR InstName Ih30
SYMATTR Value SINE(0 {H30} {f*30})
SYMBOL current 928 -1888 M90
WINDOW 0 -49 19 VRight 2
WINDOW 3 48 170 VLeft 2
WINDOW 123 0 0 Left 2
WINDOW 39 0 0 Left 2
SYMATTR InstName Ih31
SYMATTR Value SINE(0 {H31} {f*31})
SYMBOL current 928 -1760 M90
WINDOW 0 -49 19 VRight 2
WINDOW 3 48 170 VLeft 2
WINDOW 123 0 0 Left 2
WINDOW 39 0 0 Left 2
SYMATTR InstName Ih32
SYMATTR Value SINE(0 {H32} {f*32})
SYMBOL current 928 -1632 M90
WINDOW 0 -49 19 VRight 2
WINDOW 3 48 170 VLeft 2
WINDOW 123 0 0 Left 2
WINDOW 39 0 0 Left 2
SYMATTR InstName Ih33
SYMATTR Value SINE(0 {H33} {f*33})
SYMBOL current 928 -1504 M90
WINDOW 0 -49 19 VRight 2
WINDOW 3 48 170 VLeft 2
WINDOW 123 0 0 Left 2
WINDOW 39 0 0 Left 2
SYMATTR InstName Ih34
SYMATTR Value SINE(0 {H34} {f*34})
SYMBOL current 928 -1376 M90
WINDOW 0 -49 19 VRight 2
WINDOW 3 48 170 VLeft 2
WINDOW 123 0 0 Left 2
WINDOW 39 0 0 Left 2
SYMATTR InstName Ih35
SYMATTR Value SINE(0 {H35} {f*35})
SYMBOL current 928 -1248 M90
WINDOW 0 -49 19 VRight 2
WINDOW 3 48 170 VLeft 2
WINDOW 123 0 0 Left 2
WINDOW 39 0 0 Left 2
SYMATTR InstName Ih36
SYMATTR Value SINE(0 {H36} {f*36})
SYMBOL current 928 -1120 M90
WINDOW 0 -49 19 VRight 2
WINDOW 3 48 170 VLeft 2
WINDOW 123 0 0 Left 2
WINDOW 39 0 0 Left 2
SYMATTR InstName Ih37
SYMATTR Value SINE(0 {H37} {f*37})
SYMBOL current 928 -992 M90
WINDOW 0 -49 19 VRight 2
WINDOW 3 48 170 VLeft 2
WINDOW 123 0 0 Left 2
WINDOW 39 0 0 Left 2
SYMATTR InstName Ih38
SYMATTR Value SINE(0 {H38} {f*38})
SYMBOL current 928 -864 M90
WINDOW 0 -49 19 VRight 2
WINDOW 3 48 170 VLeft 2
WINDOW 123 0 0 Left 2
WINDOW 39 0 0 Left 2
SYMATTR InstName Ih39
SYMATTR Value SINE(0 {H39} {f*39})
SYMBOL current 928 -736 M90
WINDOW 0 -49 19 VRight 2
WINDOW 3 48 170 VLeft 2
WINDOW 123 0 0 Left 2
WINDOW 39 0 0 Left 2
SYMATTR InstName Ih40
SYMATTR Value SINE(0 {H40} {f*40})
TEXT -3096 -680 Left 2 !.model MYSW SW(Ron=0.01 Roff=2e6 Vt=0.5 Vh=0.3)
TEXT -3096 -656 Left 2 !.model DD D(Ron=0.01 Roff=1e6)
TEXT -3096 -608 Left 2 !.options trtol=7\n.options reltol=0.1
TEXT -464 -2072 Left 2 !.ic V(o)=0 V(or)=0
TEXT -1912 -2120 Left 2 ;3 Phase ADDC Converter With High PF Using OCC Control\n                                    May 10, 2008
TEXT -40 -2056 Left 2 ;This Block used to generate a IEC 61000-3-2 limit line in FFT spectrum
TEXT 72 -2008 Left 2 !.tran 0 {2/f} {1/f}
TEXT 72 -1968 Left 2 !.param A=16 f=50
TEXT 1280 -808 Left 2 !.param scale=10
TEXT -3088 -728 Left 2 ;;.tran 0 20ms 0 uic
TEXT 1192 -1944 Left 2 !.param H2=1.08\n.param H3=2.3\n.param H4=0.43\n.param H5=1.14\n.param H6=0.3\n.param H7=0.77\n.param H8=0.23\n.param H9=0.4\n.param H10=0.184\n.param H11=0.33\n.param H12=0.153333333333333\n.param H13=0.21\n.param H14=0.131428571428571\n.param H15=0.15\n.param H16=0.115\n.param H17=0.132352941176471\n.param H18=0.102222222222222\n.param H19=0.118421052631579\n.param H20=0.092\n.param H21=0.107142857142857\n.param H22=0.0836363636363636\n.param H23=0.0978260869565217\n.param H24=0.0766666666666667\n.param H25=0.09\n.param H26=0.0707692307692308\n.param H27=0.0833333333333333\n.param H28=0.0657142857142857\n.param H29=0.0775862068965517\n.param H30=0.0613333333333333\n.param H31=0.0725806451612903\n.param H32=0.0575\n.param H33=0.0681818181818182\n.param H34=0.0541176470588235\n.param H35=0.0642857142857143\n.param H36=0.0511111111111111\n.param H37=0.0608108108108108\n.param H38=0.0484210526315789\n.param H39=0.0576923076923077\n.param H40=0.046
TEXT 1192 -1976 Left 2 ;Class A limit value of IEC 61000-3-2
TEXT -48 -528 Left 2 ;To reduce side-effect of FFT analysis. Run whole cycles of V(iec) & Va~Vc (sources) is required.
RECTANGLE Normal 1616 -560 -96 -2032 2

The netlist it stands for:
* 3_Phase_High_PF_ACDC_Converter-add IEC61000-3-2 line (fix).asc
Lia N002 N005 750µh Rser=0.01
Lib N018 N009 750µh Rser=0.01
Lic N026 N010 750µh Rser=0.01
Cob N003 or 100µF Rser=0.1
Coa o N003 100µF Rser=0.1
RL o or 40
Risa N014 N011 0.001
Risb N015 N012 0.001
Risc N016 N013 0.001
Rx1 0 N003 100K
vrpa ra 0 PULSE(0 1 0 9980ns 10ns 10ns 10us)
Brpa N034 0 V=V(e)*V(ra)
A1 N028 N046 0 0 0 0 N037 0 SCHMITT tripdt=100ns vt=5mv vh=3mv
A2 N031 N037 0 0 0 N038 ga 0 SRFLOP tripdt=10ns td=10ns
Vosca N031 0 PULSE(0 1 0 10ns 10ns 20ns 10us)
Rai N028 N034 10K
Sa1 0 N028 N039 0 MYSW
Rfa N039 N038 100
Cfa N039 0 100pf
Bisa N046 0 V=V(e)-I(Risa)*0.5
A3 N029 N047 0 0 0 0 N040 0 SCHMITT tripdt=100ns vt=5mv vh=3mv
A4 N032 N040 0 0 0 N041 gb 0 SRFLOP tripdt=10ns td=10ns
Rbi N029 N035 10K
Sb1 0 N029 N042 0 MYSW
Rfb N042 N041 100
Cfb N042 0 100pf
Bisb N047 0 V=V(e)-i(Risb)*0.5
A5 N030 N048 0 0 0 0 N043 0 SCHMITT tripdt=100ns vt=5mv vh=3mv
A6 N033 N043 0 0 0 N044 gc 0 SRFLOP tripdt=10ns td=10ns
Rci N030 N036 10K
Sc1 0 N030 N045 0 MYSW
Rfc N045 N044 100
Cfc N045 0 100pf
Bisc N048 0 V=V(e)-I(Risc)*0.5
vrpb rb 0 PULSE(0 1 3.333us 9980ns 10ns 10ns 10us)
Brpb N035 0 V=V(e)*V(rb)
vrpc rc 0 PULSE(0 1 6.666us 9980ns 10ns 10ns 10us)
Brpc N036 0 V=V(e)*V(rc)
Voscb N032 0 PULSE(0 1 3.333us 10ns 10ns 20ns 10us)
Voscc N033 0 PULSE(0 1 6.666us 10ns 10ns 20ns 10us)
Rd1 N021 N020 993.6K
Rd2 N020 0 18.4K
Rz N022 N020 1K
Cp e N022 0.0047µf
Ccp e N020 1000pf
V§7V N025 0 PULSE(0 7 0 1u)
Bfb N021 0 V=V(o,or)
V§30V N023 0 PULSE(0 30 0 1us)
Sa N014 N006 ga 0 MYSW
Sb N015 N007 gb 0 MYSW
Sc N016 N008 gc 0 MYSW
Da1 N005 N006 DD
Da2 N011 N005 DD
Da3 N003 N006 DD
Da4 N011 N003 DD
Db1 N009 N007 DD
Db2 N012 N009 DD
Db3 N003 N007 DD
Db4 N012 N003 DD
Dc1 N010 N008 DD
Dc2 N013 N010 DD
Dc3 N003 N008 DD
Dc4 N013 N003 DD
Daf N006 o DD
Dbf N007 o DD
Dcf N008 o DD
Dar or N014 DD
Dbr or N015 DD
Dcr or N016 DD
Va N004 0 SINE(0 134 {f})
Vb N019 0 SINE(0 134 {f} 0 0 120)
Vc N027 0 SINE(0 134 {f} 0 0 240)
La1 N004 N001 20µh Rser=0.01
La2 N001 N002 120µh Rser=0.01
C1 N001 N017 0.12µf Rser=0.01 Cpar=100pf
C2 N002 N018 0.47µf Rser=0.01 Cpar=100pf
Rdpa1 N001 N002 14
Lb1 N019 N017 20µh Rser=0.01
Lb2 N017 N018 120µh Rser=0.01
C3 N017 N024 0.12µf Rser=0.01 Cpar=100pf
Rdpa2 N017 N018 14
Lc1 N027 N024 20µh Rser=0.01
Lc2 N024 N026 120µh Rser=0.01
Rdpa3 N024 N026 14
C4 N001 N024 0.12µf Rser=0.01 Cpar=100pf
C5 N018 N026 0.47µf Rser=0.01 Cpar=100pf
C6 N002 N026 0.47µf Rser=0.01 Cpar=100pf
XUea N025 N020 N023 0 e level.2 Avol=1Meg GBW=10Meg Slew=10Meg ilimit=25m rail=0 Vos=0 phimargin=45 en=0 enk=0 in=0 ink=0 Rin=500Meg  ; pins IN+ IN- V+ V- OUT
Vh1 iec 0 SINE(0 {A} {f}) Rser=1
Ih2 0 iec SINE(0 {H2} {f*2})
Ih3 0 iec SINE(0 {H3} {f*3})
V2 iec2 0 sin 0 {A} {f/scale} rser=1
I3 0 iec2 sin 0 {A*1.08/16} {f*2/scale}
I4 0 iec2 sin 0 {A*2.3/16} {f*3/scale}
Ih4 0 iec SINE(0 {H4} {f*4})
Ih5 0 iec SINE(0 {H5} {f*5})
Ih6 0 iec SINE(0 {H6} {f*6})
Ih7 0 iec SINE(0 {H7} {f*7})
Ih8 0 iec SINE(0 {H8} {f*8})
Ih9 0 iec SINE(0 {H9} {f*9})
Ih10 0 iec SINE(0 {H10} {f*10})
Ih11 0 iec SINE(0 {H11} {f*11})
Ih12 0 iec SINE(0 {H12} {f*12})
Ih13 0 iec SINE(0 {H13} {f*13})
Ih14 0 iec SINE(0 {H14} {f*14})
Ih15 0 iec SINE(0 {H15} {f*15})
Ih16 0 iec SINE(0 {H16} {f*16})
Ih17 0 iec SINE(0 {H17} {f*17})
Ih18 0 iec SINE(0 {H18} {f*18})
Ih19 0 iec SINE(0 {H19} {f*19})
Ih20 0 iec SINE(0 {H20} {f*20})
Ih21 0 iec SINE(0 {H21} {f*21})
Ih22 0 iec SINE(0 {H22} {f*22})
Ih23 0 iec SINE(0 {H23} {f*23})
Ih24 0 iec SINE(0 {H24} {f*24})
Ih25 0 iec SINE(0 {H25} {f*25})
Ih26 0 iec SINE(0 {H26} {f*26})
Ih27 0 iec SINE(0 {H27} {f*27})
Ih28 0 iec SINE(0 {H28} {f*28})
Ih29 0 iec SINE(0 {H29} {f*29})
Ih30 0 iec SINE(0 {H30} {f*30})
Ih31 0 iec SINE(0 {H31} {f*31})
Ih32 0 iec SINE(0 {H32} {f*32})
Ih33 0 iec SINE(0 {H33} {f*33})
Ih34 0 iec SINE(0 {H34} {f*34})
Ih35 0 iec SINE(0 {H35} {f*35})
Ih36 0 iec SINE(0 {H36} {f*36})
Ih37 0 iec SINE(0 {H37} {f*37})
Ih38 0 iec SINE(0 {H38} {f*38})
Ih39 0 iec SINE(0 {H39} {f*39})
Ih40 0 iec SINE(0 {H40} {f*40})
.model D D
.lib standard.dio
.model MYSW SW(Ron=0.01 Roff=2e6 Vt=0.5 Vh=0.3)
.model DD D(Ron=0.01 Roff=1e6)
.options trtol=7
.options reltol=0.1
.ic V(o)=0 V(or)=0
* 3 Phase ADDC Converter With High PF Using OCC Control
*                                     May 10, 2008
* This Block used to generate a IEC 61000-3-2 limit line in FFT spectrum
.tran 0 {2/f} {1/f}
.param A=16 f=50
.param scale=10
* ;.tran 0 20ms 0 uic
.param H2=1.08
.param H3=2.3
.param H4=0.43
.param H5=1.14
.param H6=0.3
.param H7=0.77
.param H8=0.23
.param H9=0.4
.param H10=0.184
.param H11=0.33
.param H12=0.153333333333333
.param H13=0.21
.param H14=0.131428571428571
.param H15=0.15
.param H16=0.115
.param H17=0.132352941176471
.param H18=0.102222222222222
.param H19=0.118421052631579
.param H20=0.092
.param H21=0.107142857142857
.param H22=0.0836363636363636
.param H23=0.0978260869565217
.param H24=0.0766666666666667
.param H25=0.09
.param H26=0.0707692307692308
.param H27=0.0833333333333333
.param H28=0.0657142857142857
.param H29=0.0775862068965517
.param H30=0.0613333333333333
.param H31=0.0725806451612903
.param H32=0.0575
.param H33=0.0681818181818182
.param H34=0.0541176470588235
.param H35=0.0642857142857143
.param H36=0.0511111111111111
.param H37=0.0608108108108108
.param H38=0.0484210526315789
.param H39=0.0576923076923077
.param H40=0.046
* Class A limit value of IEC 61000-3-2
* To reduce side-effect of FFT analysis. Run whole cycles of V(iec) & Va~Vc (sources) is required.
.lib UniversalOpamps2.sub
.backanno
.end